# Altium schematic sheet [14] - TK2560_RevisionHistory.SchDoc
size A4; DocumentNumber: 4; SheetNumber: 15; SheetTotal: 15
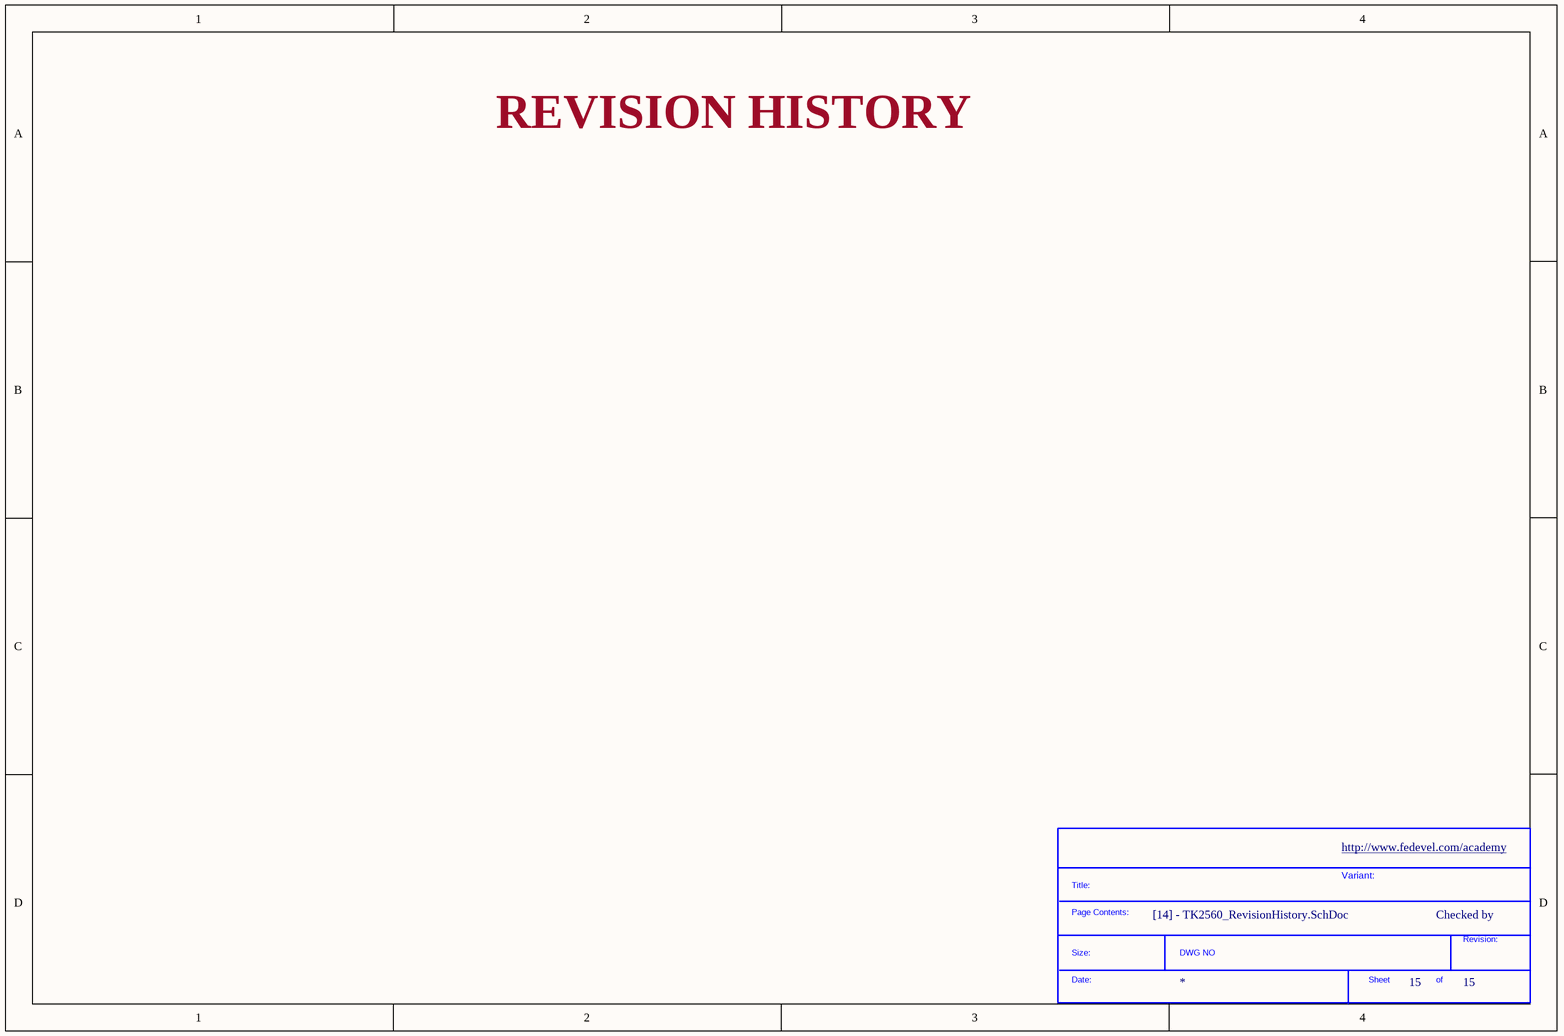
[diagram p0: [14] - TK2560_RevisionHistory.SchDoc]

## Parts
*  SDTitleBlock  (value not drawn)  (graphical)

## Notes on the sheet
- REVISION HISTORY
- http://www.fedevel.com/academy
- Variant:
- Checked by
- (in symbol SDTitleBlock) Title:; Page Contents:; Revision:; Size:; DWG NO; Date:; Sheet; of